# Altium schematic sheet Connect to controler.SchDoc
size A4; SheetNumber: 9; SheetTotal: 9
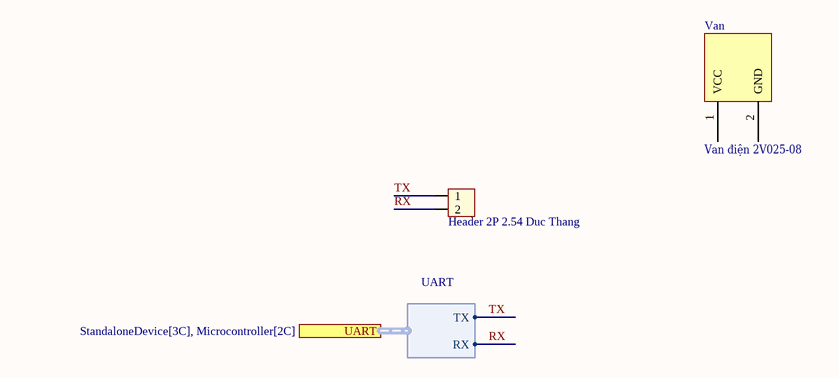
[diagram p0: Connect to controler.SchDoc]

## Parts
UART  Header 2P 2.54 Duc Thang  [XH2.54M-2]
Van  Van điện 2V025-08  [Van 2V025-08]

## Ports
UART (harness UART, see StandaloneDevice[3C], Microcontroller[2C])

## Harnesses
UART: TX, RX

## Nets
RX: UART.2 ; port UART.RX
TX: UART.1 ; port UART.TX

Not connected (* = marked no-connect by the designer): Van 1(VCC) 2(GND)

## Library data of the parts
UART = Header 2P 2.54 Duc Thang: Cắm; Ten_Linh_Kien: Header 2P XH2.54-2P Đực Thẳng; Don_Vi: Con; Ma_Hang: MH001283; Chung_Loai: Cắm